# Altium project ENEL400.PrjPcb
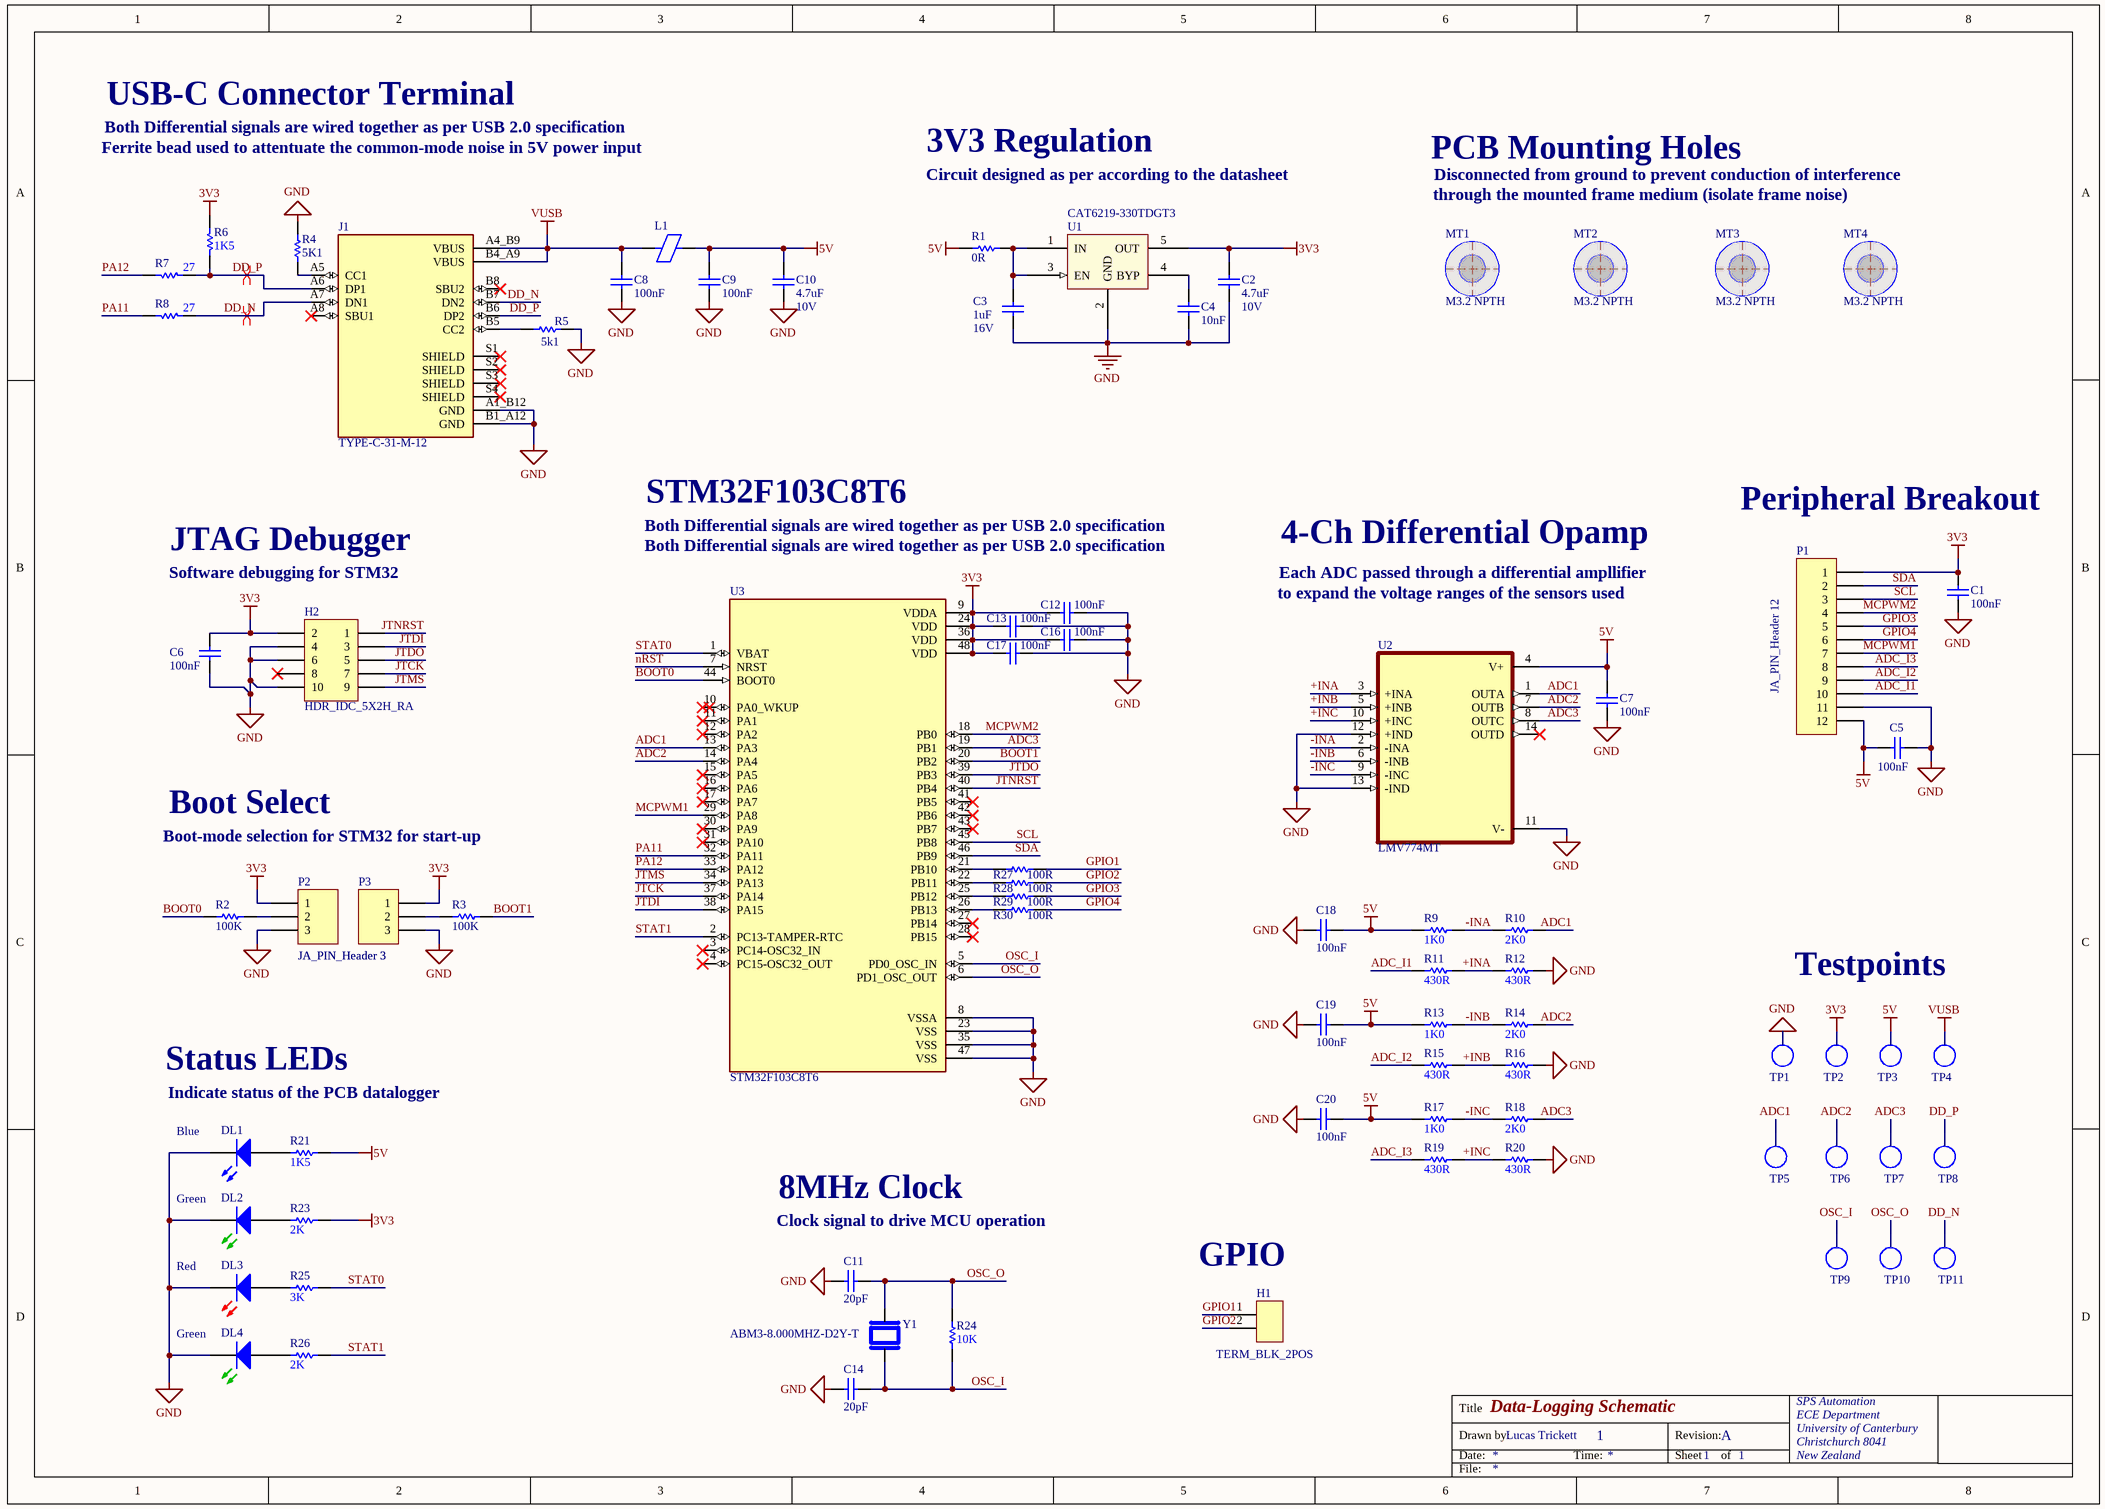
[diagram p0: Sheet1.SchDoc]
1 sheet, 78 parts. Net scope: global (net labels, ports and power ports of the same name join across sheets).
Board file: PCB1.PcbDoc

## Sheet Sheet1.SchDoc: Data-Logging Schematic
size A3; Author: Lucas Trickett; CompanyName: SPS Automation; DrawnBy: Lucas Trickett; Organization: SPS Automation; Address1: ECE Department; Address2: University of Canterbury; Address3: Christchurch 8041; Address4: New Zealand; DocumentNumber: 1; Revision: A; SheetNumber: 1; SheetTotal: 1

### Parts
C1  100nF  [CAPC1608L]
C2  Max Voltage: 10V  [CAPC1608N]  (hidden comment: 4.7uF)
C3  Max Voltage: 16V  [CAPC1608L]  (hidden comment: 1uF)
C4  10nF  [CAPC1608L]
C5  100nF  [CAPC1608L]
C6  100nF  [CAPC1608L]
C7  100nF  [CAPC1608L]
C8  100nF  [CAPC1608L]
C9  100nF  [CAPC1608L]
C10  Max Voltage: 10V  [CAPC1608N]  (hidden comment: 4.7uF)
C11  value 20pF  [CAPC1608L]  (hidden comment: 10pF)
C12  100nF  [CAPC1608L]
C13  100nF  [CAPC1608L]
C14  value 20pF  [CAPC1608L]  (hidden comment: 10pF)
C16  100nF  [CAPC1608L]
C17  100nF  [CAPC1608L]
C18  100nF  [CAPC1608L]
C19  100nF  [CAPC1608L]
C20  100nF  [CAPC1608L]
DL1  Blue  [WL-SMCW0603]
DL2  Green  [WL-SMCW0603]
DL3  Red  [WL-SMCW0603]
DL4  Green  [WL-SMCW0603]
H1  TERM_BLK_2POS  [TERM_BLK_2POS]
H2  HDR_IDC_5X2H_RA  [IDC2.54-H10C]
J1  TYPE-C-31-M-12  [HRO_TYPE-C-31-M-12]
L1  1A max, Idc 0.3R,  [INDC3216L]  (value not drawn)
MT1  M3.2 NPTH  [MNT-HOLE_3.2mm_NPTH]  (no BOM)
MT2  M3.2 NPTH  [MNT-HOLE_3.2mm_NPTH]  (no BOM)
MT3  M3.2 NPTH  [MNT-HOLE_3.2mm_NPTH]  (no BOM)
MT4  M3.2 NPTH  [MNT-HOLE_3.2mm_NPTH]  (no BOM)
P1  JA_PIN_Header 12  [HDR1X12]
P2  JA_PIN_Header 3  [HDR1X3]
P3  JA_PIN_Header 3  [HDR1X3]
R1  0R  [RESC1608L]
R2  100K  [RESC1608L]
R3  100K  [RESC1608L]
R4  5K1  [RESC1608L]
R5  5k1  [RESC1608L]
R6  1K5  [RESC1608L]
R7  27  [RESC1608L]
R8  27  [RESC1608L]
R9  1K0  [RESC1608L]
R10  2K0  [RESC1608L]
R11  430R  [RESC1608L]
R12  430R  [RESC1608L]
R13  1K0  [RESC1608L]
R14  2K0  [RESC1608L]
R15  430R  [RESC1608L]
R16  430R  [RESC1608L]
R17  1K0  [RESC1608L]
R18  2K0  [RESC1608L]
R19  430R  [RESC1608L]
R20  430R  [RESC1608L]
R21  1K5  [RESC1608L]
R23  2K  [RESC1608L]
R24  10K  [RESC1608L]
R25  3K  [RESC1608L]
R26  2K  [RESC1608L]
R27  100R  [RESC1608L]
R28  100R  [RESC1608L]
R29  100R  [RESC1608L]
R30  100R  [RESC1608L]
TP1  TP_0603  [TP_0603]  (value not drawn)
TP2  TP_0603  [TP_0603]  (value not drawn)
TP3  TP_0603  [TP_0603]  (value not drawn)
TP4  TP_0603  [TP_0603]  (value not drawn)
TP5  TP_0603  [TP_0603]  (value not drawn)
TP6  TP_0603  [TP_0603]  (value not drawn)
TP7  TP_0603  [TP_0603]  (value not drawn)
TP8  TP_0603  [TP_0603]  (value not drawn)
TP9  TP_0603  [TP_0603]  (value not drawn)
TP10  TP_0603  [TP_0603]  (value not drawn)
TP11  TP_0603  [TP_0603]  (value not drawn)
U1  CAT6219-330TDGT3  [SOT95P280X145-5N]
U2  LMV774MT  [SOP65P640X120-14N]
U3  STM32F103C8T6  [QFP50P900X900X160-48N]
Y1  ABM3-8.000MHZ-D2Y-T  [XTAL_ABM3-8.000MHZ-D2Y-T]

### Nets
3V3: C1.1 C2.1 C6.2 C12.2 C13.2 C16.2 C17.2 H2.2 P1.1 P2.1 P3.1 R6.1 R23.2 TP2.1(TP) U1.5(OUT) U3.9(VDDA) U3.24(VDD) U3.36(VDD) U3.48(VDD)
5V: C5.2 C7.2 C9.1 C10.2 C18.2 C19.2 C20.2 L1.2 P1.12 R1.2 R9.1 R13.1 R17.1 R21.2 TP3.1(TP) U2.4(V+)
GND: C1.2 C2.2 C3.2 C4.2 C5.1 C6.1 C7.1 C8.2 C9.2 C10.1 C11.1 C12.1 C13.1 C14.1 C16.1 C17.1 C18.1 C19.1 C20.1 DL1.1(K) DL2.1(K) DL3.1(K) DL4.1(K) H2.4 H2.6 H2.10 J1.A1_B12(GND) J1.B1_A12(GND) P1.11 P2.3 P3.3 R4.2 R5.2 R12.1 R16.1 R20.1 TP1.1(TP) U1.2(GND) U2.11(V-) U2.12(+IND) U2.13(-IND) U3.8(VSSA) U3.23(VSS) U3.35(VSS) U3.47(VSS)
VUSB: C8.1 J1.A4_B9(VBUS) J1.B4_A9(VBUS) L1.1 TP4.1(TP)
+INA: R11.2 R12.2 U2.3(+INA)
+INB: R15.2 R16.2 U2.5(+INB)
+INC: R19.2 R20.2 U2.10(+INC)
-INA: R9.2 R10.1 U2.2(-INA)
-INB: R13.2 R14.1 U2.6(-INB)
-INC: R17.2 R18.1 U2.9(-INC)
ADC1: R10.2 TP5.1(TP) U2.1(OUTA) U3.13(PA3)
ADC2: R14.2 TP6.1(TP) U2.7(OUTB) U3.14(PA4)
ADC3: R18.2 TP7.1(TP) U2.8(OUTC) U3.19(PB1)
ADC_I1: P1.10 R11.1
ADC_I2: P1.9 R15.1
ADC_I3: P1.8 R19.1
BOOT0: R2.1 U3.44(BOOT0)
BOOT1: R3.2 U3.20(PB2)
DD_N: J1.A7(DN1) J1.B7(DN2) R8.2 TP11.1(TP)
DD_P: J1.A6(DP1) J1.B6(DP2) R6.2 R7.2 TP8.1(TP)
GPIO1: H1.1 R27.2
GPIO2: H1.2 R28.2
GPIO3: P1.5 R29.2
GPIO4: P1.6 R30.2
JTCK: H2.7 U3.37(PA14)
JTDI: H2.3 U3.38(PA15)
JTDO: H2.5 U3.39(PB3)
JTMS: H2.9 U3.34(PA13)
JTNRST: H2.1 U3.40(PB4)
MCPWM1: P1.7 U3.29(PA8)
MCPWM2: P1.4 U3.18(PB0)
nRST: U3.7(NRST)
OSC_I: C14.2 R24.1 TP9.1(TP) U3.5(PD0_OSC_IN) Y1.1
OSC_O: C11.2 R24.2 TP10.1(TP) U3.6(PD1_OSC_OUT) Y1.2
PA11: R8.1 U3.32(PA11)
PA12: R7.1 U3.33(PA12)
SCL: P1.3 U3.45(PB8)
SDA: P1.2 U3.46(PB9)
STAT0: R25.2 U3.1(VBAT)
STAT1: R26.2 U3.2(PC13-TAMPER-RTC)
NetC3_1: C3.1 R1.1 U1.1(IN) U1.3(EN)
NetC4_1: C4.1 U1.4(BYP)
NetDL1_2: DL1.2(A) R21.1
NetDL2_2: DL2.2(A) R23.1
NetDL3_2: DL3.2(A) R25.1
NetDL4_2: DL4.2(A) R26.1
NetJ1_A5: J1.A5(CC1) R4.1
NetJ1_B5: J1.B5(CC2) R5.1
NetP2_2: P2.2 R2.2
NetP3_2: P3.2 R3.1
NetR27_1: R27.1 U3.21(PB10)
NetR28_1: R28.1 U3.22(PB11)
NetR29_1: R29.1 U3.25(PB12)
NetR30_1: R30.1 U3.26(PB13)

Not connected (* = marked no-connect by the designer): H2 8*; J1 A8(SBU1)* B8(SBU2)* S1(SHIELD)* S2(SHIELD)* S3(SHIELD)* S4(SHIELD)*; U2 14(OUTD)*; U3 3(PC14-OSC32_IN)* 4(PC15-OSC32_OUT)* 10(PA0_WKUP)* 11(PA1)* 12(PA2)* 15(PA5)* 16(PA6)* 17(PA7)* 27(PB14)* 28(PB15)* 30(PA9)* 31(PA10)* 41(PB5)* 42(PB6)* 43(PB7)*

### Layout directives
differential pair: DD_N, DD_P

### Notes on the sheet
- USB-C Connector Terminal
- Both Differential signals are wired together as per USB 2.0 specification
- Ferrite bead used to attentuate the common-mode noise in 5V power input
- 3V3 Regulation
- Circuit designed as per according to the datasheet
- PCB Mounting Holes
- Disconnected from ground to prevent conduction of interference
- through the mounted frame medium (isolate frame noise)
- STM32F103C8T6
- Peripheral Breakout
- Software debugging for STM32
- JTAG Debugger
- to expand the voltage ranges of the sensors used
- 4-Ch Differential Opamp
- Each ADC passed through a differential ampllifier
- Boot Select
- Boot-mode selection for STM32 for start-up
- Testpoints
- Status LEDs
- Indicate status of the PCB datalogger
- 8MHz Clock
- (near C11) Clock signal to drive MCU operation
- (near H1) GPIO
- Title
- Drawn by:
- Date:
- Time:
- Revision:
- Sheet
- of
- File:

### Library data of the parts
C1 C4-C9 C12 C13 C16-C20 = CC_10nF_0603: CAP CER 10nF X7R +-10% 50V 0603; PackageReference: 0603; Code_IPC: 1608 [0603]; Verify: *; Supplier: ECE Dept; Storage Location: PCB Assembly WS
  C1 C5-C9 C12 C13 C16-C20: Value: 100nF
  C4: Value: 10nF
C2 C10 = CC_4.7uF_0603: CAP CER 4.7uF X5R +-20%  10V 0603; Note: Footprint corresponds to dimensions for bulk cassette packaging. This case size has tightened tolerances.; PackageReference: 0805; Code_IPC: 2012[0805]; Verify: *; Supplier: ECE Dept; Storage Location: PCB Assembly WS; Value: 4.7uF
C3 = CC_1uF_0603: CAP CER 1uF Y5V -20% +80% 16V 0603; PackageReference: 0603; Code_IPC: 1608 [0603]; Verify: *; Supplier: ECE Dept; Storage Location: PCB Assembly WS; Value: 1uF
C11 C14 = CC_27pF_0603: CAP CER 27pF NPO/COG +-5% 50V 0603; PackageReference: 0603; Code_IPC: 1608 [0603]; Verify: *; Supplier: ECE Dept; Storage Location: PCB Assembly WS
DL1 = DL_150060BS75000: LED Blue 270mcd 0603 SMD; Manufacturer: WURTH ELEKTRONIK; Forward Current If: 30; Forward Voltage: 3.2; Luminous Intensity: 270; Viewing Angle: 120°; Wavelength Typ: 470; Pricing: 1=0.3844, 50=0.3252, 100=0.2957, 500=0.2365 (NZD); Supplier 1: Farnell; Supplier Part Number 1: 2322069; Manufacturer Part Number: 150060BS75000; Storage Location: PCB Assembly WS; Supplier: ECE Dept; LED Colour: Blue
DL2 DL4 = DL_150060GS75000: LED Green 430mcd 0603 SMD; Manufacturer: WURTH ELEKTRONIK; Forward Current If: 30; Wavelength Typ: 520; Forward Voltage: 3.2; Lens Shape: Rectangular; Luminous Intensity: 430; Viewing Angle: 140°; LED Mounting: SMD; Supplier 1: Farnell; Supplier Part Number 1: 2322070; Manufacturer Part Number: 150060GS75000; Storage Location: PCB Assembly WS; Supplier: ECE Dept; LED Colour: Green
DL3 = DL_150060RS75000: LED Red 250mcd 0603 SMD; Manufacturer: WURTH ELEKTRONIK; Forward Current If: 30; Forward Voltage: 2; Lens Shape: Rectangular; Luminous Intensity: 250; Wavelength Typ: 625; Viewing Angle: 140°; LED Mounting: SMD; Supplier 1: Farnell; Supplier Part Number 1: 2322071; Manufacturer Part Number: 150060RS75000; Storage Location: PCB Assembly WS; Supplier: ECE Dept; LED Colour: Red
H1 = TERM_BLK_2POS: 2 Position Terminal Block 7.62mm spacing
H2 = JA_HDR_IDC_5X2_R/A: IDC Header, 2.54mm, 10-Pin, Right Angle; Supplier: ECE Dept; Supplier 1: Farnell; Supplier Part Number 1: 1106840; Storage Location: ECE Dept Store
J1 = CMP-013-000000-1: USB Connectors 24 Receptacle 1 8.94*7.3mm RoHS; MF: HRO Electronics Co., Ltd.; Design Item ID: TYPE-C-31-M-12; SnapEDA_Link: https://www.snapeda.com/parts/TYPE-C-31-M-12/HRO+Electronics+Co.%252C+Ltd./view-part/?ref=snap; Check_prices: https://www.snapeda.com/parts/TYPE-C-31-M-12/HRO+Electronics+Co.%252C+Ltd./view-part/?ref=eda; MP: TYPE-C-31-M-12; Price: None; Pin Count: 16; Package: Package; Source: TYPE-C-31-M-12.SchLib; Availability: Not in stock; Value: *; Component Type: Standard
L1 = IN_Ferrite-Bead: Ferrite Bead, Rdc 0.3R, Z100MHZ 600R, Imax 1A, SMD 1206; Manufacturer: FAIR-RITE; Manufacturer PN: 2512066017Y1; DC Current Rating: 1; DC Resistance Max: 0.08; Ferrite Case Style: 1206 ^3216 Metric]; Frequency Range: 50MHz to 1; Impedance: 600; Impedance Tolerance: ± 25%; Supplier: ECE Dept; Storage Location: PCB Assembly WS; Ferrite Mounting: SMD; Supplier 1: Farnell; Supplier Part Number 1: 1612060; Manufacturer Part Number: 2512066017Y1; Value: 1A max, Idc 0.3R,
MT1-MT4 = MC_M3.2_HOLE: Fixing M3.2 Mount Hole NPTH; Manufacturer: Hi-Q; Manufacturer PN: 3BV series M3 Clearance; price: 0; Supplier: ECE Dept; value: M3.2 NPTH
P1 = JA_PIN_Header 12: Header, 12-Pin; LatestRevisionDate: 17-Jul-2002; LatestRevisionNote: Re-released for DXP Platform.; Publisher: Altium Limited
P2 P3 = JA_PIN_Header 3: Header, 3-Pin; LatestRevisionDate: 17-Jul-2002; LatestRevisionNote: Re-released for DXP Platform.; Publisher: Altium Limited
R1 = RS_0R0: RES 0.0 OHM 1/10W 5% 0603 SMD; Storage Location: PCB Assembly WS; Supplier: ECE Dept; Value: 0R
R2-R5 = RS_100K: RES 100K OHM 1/10W 5% 0603 SMD; Storage Location: PCB Assembly WS; Supplier: ECE Dept
  R2 R3: Value: 100K
  R4: Value: 5K1
  R5: Value: 5k1
R6-R8 R21 R23 R24 R26 = RS_2K: RES 2K OHM 1/10W 5% 0603 SMD; Storage Location: PCB Assembly WS; Supplier: ECE Dept
  R6 R21: Value: 1K5
  R7 R8: Value: 27
  R23 R26: Value: 2K
  R24: Value: 10K
R9-R20 = RS_430R: RES 430 OHM 1/10W 5% 0603 SMD; Storage Location: PCB Assembly WS; Supplier: ECE Dept
  R9 R13 R17: Value: 1K0
  R10 R14 R18: Value: 2K0
  R11 R12 R15 R16 R19 R20: Value: 430R
R25 = RS_3K: RES 3K OHM 1/10W 5% 0603 SMD; Storage Location: PCB Assembly WS; Supplier: ECE Dept; Value: 3K
R27-R30 = RS_100R: RES 100 OHM 1/10W 5% 0603 SMD; Storage Location: PCB Assembly WS; Supplier: ECE Dept; Value: 100R
TP1-TP11 = TP_0603: Test Point 1.65X0.9X1.2mm SMD; Manufacturer: TE Connectivity AMP Connectors; Manufacturer Part Number: 1625854-3; Supplier 1: Digi-Key; Mounting Type: Surface Mount; Terminal: 0.063" x 0.031" x 0.045" (1.60mm x 0.80mm x 1.15mm); Type: PC Test Point; Supplier Part Number 1: A106145CT-ND
U1 = SV_CAT6219-330TDGT3: IC REG LIN 3.3V 500MA TSOT23-5; Voltage - Input (Max): 5.5V; Voltage Dropout (Max): 0.5V @ 500mA; Manufacturer Part Number: CAT6219-330TDGT3; Base Part Number: CAT6219; Current - Output: 500mA; Package / Case: SOT-23-5 Thin, TSOT-23-5; Supplier: Digi-Key; Supplier Device Package: TSOT-23-5; Voltage - Output (Min/Fixed): 3.3V; ComponentLink1URL: http://www.onsemi.com/pub/Collateral/CAT6219-D.PDF; ComponentLink1Description: http://www.onsemi.com/pub/Collateral/CAT6219-D.PDF; Supplier 1: Digi-Key; ComponentLink2Description: CAT6219 Datasheet; ComponentLink2URL: \\maxwell\elecapp\AltiumDesigner\Libraries\DatasheetsNew\ENCE461\CAT6219-D.PDF; Supplier Part Number: CAT6219-330TDGT3
U2 = CMP-014-00002-1: Quad, Low Offset, Low Noise, RRO Operational Amplifiers; MP: LMV774MTX/NOPB; MF: Texas Instruments; Source: LMV774MT.SchLib; Check_prices: https://www.snapeda.com/parts/LMV774MTX/NOPB/Texas+Instruments/view-part/?ref=eda; Value: *; SnapEDA_Link: https://www.snapeda.com/parts/LMV774MTX/NOPB/Texas+Instruments/view-part/?ref=snap; Component Type: Standard; Design Item ID: LMV774MT; Digi-Key_Part_Number: LMV774MTX/NOPBTR-ND; Purchase-URL: https://pricing.snapeda.com/search/part/LMV774MTX/NOPB/?ref=eda; Pins: 14; Case/Package: TSSOP-14 Texas Instruments
U3 = CMP-031-00007-1: ARM® Cortex®-M3 STM32F1 Microcontroller IC 32-Bit 72MHz 64KB (64K x 8) FLASH 48-LQFP (7x7); MF: STMicroelectronics; Case/Package: LQFP-48 STMicroelectronics; Design Item ID: STM32F103C8T6; Pins: 48; MP: STM32F103C8T6; Value: *; Source: STM32F103C8T6.SchLib; Check_prices: https://www.snapeda.com/parts/STM32F103C8T6/STMicroelectronics/view-part/?ref=eda; Component Type: Standard; SnapEDA_Link: https://www.snapeda.com/parts/STM32F103C8T6/STMicroelectronics/view-part/?ref=snap
Y1 = CMP-003-00030-1: 8 MHz Â±20ppm Crystal 18pF 140 Ohms 2-SMD, No Lead; MF: Abracon; Source: ABM3-8.000MHZ-D2Y-T.SchLib; Design Item ID: ABM3-8.000MHZ-D2Y-T; Price: None; Case/Package: SMD-2 Abracon; Component Type: Standard; Pins: 2; Check_prices: https://www.snapeda.com/parts/ABM3-8.000MHZ-D2Y-T/Abracon+LLC/view-part/?ref=eda; Value: *; Purchase-URL: https://pricing.snapeda.com/search/part/ABM3-8.000MHZ-D2Y-T/?ref=eda; MP: ABM3-8.000MHZ-D2Y-T; Availability: In Stock; SnapEDA_Link: https://www.snapeda.com/parts/ABM3-8.000MHZ-D2Y-T/Abracon+LLC/view-part/?ref=snap